# Altium schematic sheet CANbus.SchDoc: CANbus Module
size A4; Author: Nikola Rašević; Organization: Memristor Robotics
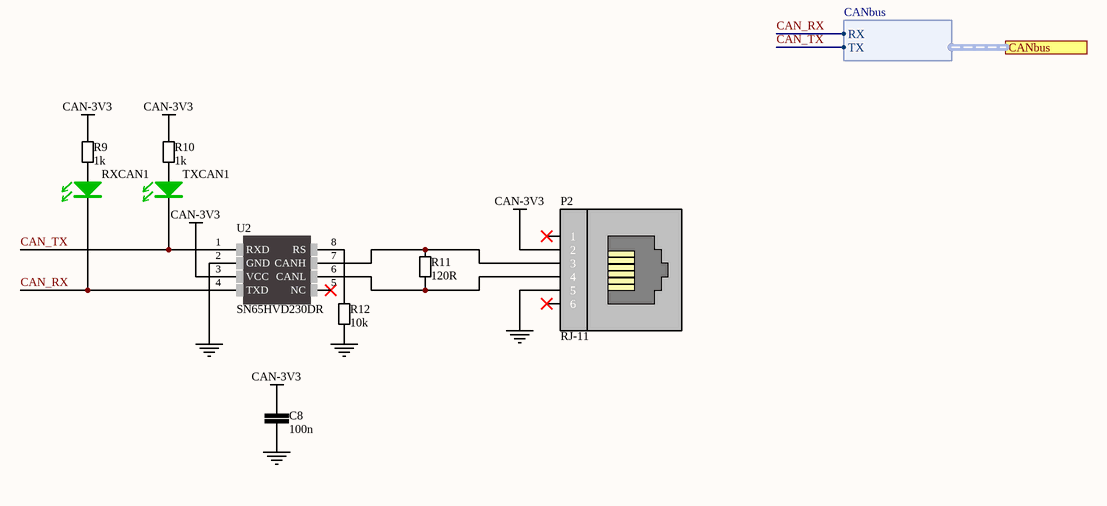
[diagram p0: CANbus.SchDoc]

## Parts
C8  100n  [CER_0603]
P2  RJ-11  [RJ11-6N-B]
R9  1k  [RESC2013X38N-0805-NOOVERLAY]
R10  1k  [RESC2013X38N-0805-NOOVERLAY]
R11  120R  [RESC2013X38N-0805-NOOVERLAY]
R12  10k  [RESC2013X38N-0805-NOOVERLAY]
RXCAN1  LED GREEN  [LED_GREEN_0805]  (value not drawn)
TXCAN1  LED GREEN  [LED_GREEN_0805]  (value not drawn)
U2  SN65HVD230DR  [SOIC-8]

## Ports
CANbus (harness CANbus)

## Harnesses
CANbus: RX, TX

## Nets
CAN-3V3: C8.2 P2.2 R9.2 R10.2 U2.3(VCC)
GND: C8.1 P2.5 R12.1 U2.2(GND)
CAN_RX: RXCAN1.1(C) U2.4(TXD) ; port CANbus.RX
CAN_TX: TXCAN1.1(C) U2.1(RXD) ; port CANbus.TX
NetP2_3: P2.3 R11.1 U2.7(CANH)
NetP2_4: P2.4 R11.2 U2.6(CANL)
NetR9_1: R9.1 RXCAN1.2(A)
NetR10_1: R10.1 TXCAN1.2(A)
NetR12_2: R12.2 U2.8(RS)

Not connected (* = marked no-connect by the designer): P2 1* 6*; U2 5(NC)*

## Notes on the sheet
- Title
- Date:
- Design Engineer:
- Time:
- Revision:
- Sheet
- of
- Size:
- A4
- www.memristor-robotics.io
- File:

## Library data of the parts
C8 = 06032105: CAP CER 100n 10V X5R 10% 0603; Capacitance: 100n
P2 = 00000001: Manufacturer Part Number: RJ-11
R9 R10 = 00001001: RES SMD 1 kOhm 1/8W 0805; Power: 0.125W, 1/8W; Barcode: 00009101; Resistance: 1k; Assembly: SMD
R11 = 000001200: RES SMD 120 Ohm 1/8W 0805; Resistance: 120R
R12 = 000001002: RES SMD 10 kOhm 1/8W 0805; Resistance: 10k
RXCAN1 TXCAN1 = LED_GREEN 0805: LED GREEN CLEAR 0805 SMD; Manufacturer: Kingbright; Manufacturer Part Number: APT2012SGC; Barcode: 2911010024338; id: 28; Voltage Forward: 2.2V; Wavelength: 568nm; Lens Color: Colorless; item_id: 3342; Recommended Rating: Platinum; Category: Optoelectronics; Assembly: SMD; Datasheet URL: http://www.kingbrightusa.com/images/catalog/SPEC/APT2012SGC.pdf; Package Case: 0805 (2012 Metric); Color: Green; Family: LED; Lens Transparency: Clear; Part Type: Optoelectronics
U2 = SN65HVD230: IC EMC CAN TRANSCEIVER 8-SOIC; Assembly: SMD; Barcode: 00000001; Manufacturer Part Number: SN65HVD230DR; Comet Product Page: http://store.comet.rs/Catalogue/Product/9057/; Datasheet Link: http://www.ti.com/lit/ds/symlink/sn65hvd232.pdf; Category: Integrated Circuits (ICs); Package: SOIC-8; Family: Comunication